# EAGLE design ControlID (EAGLE 9.6.2)
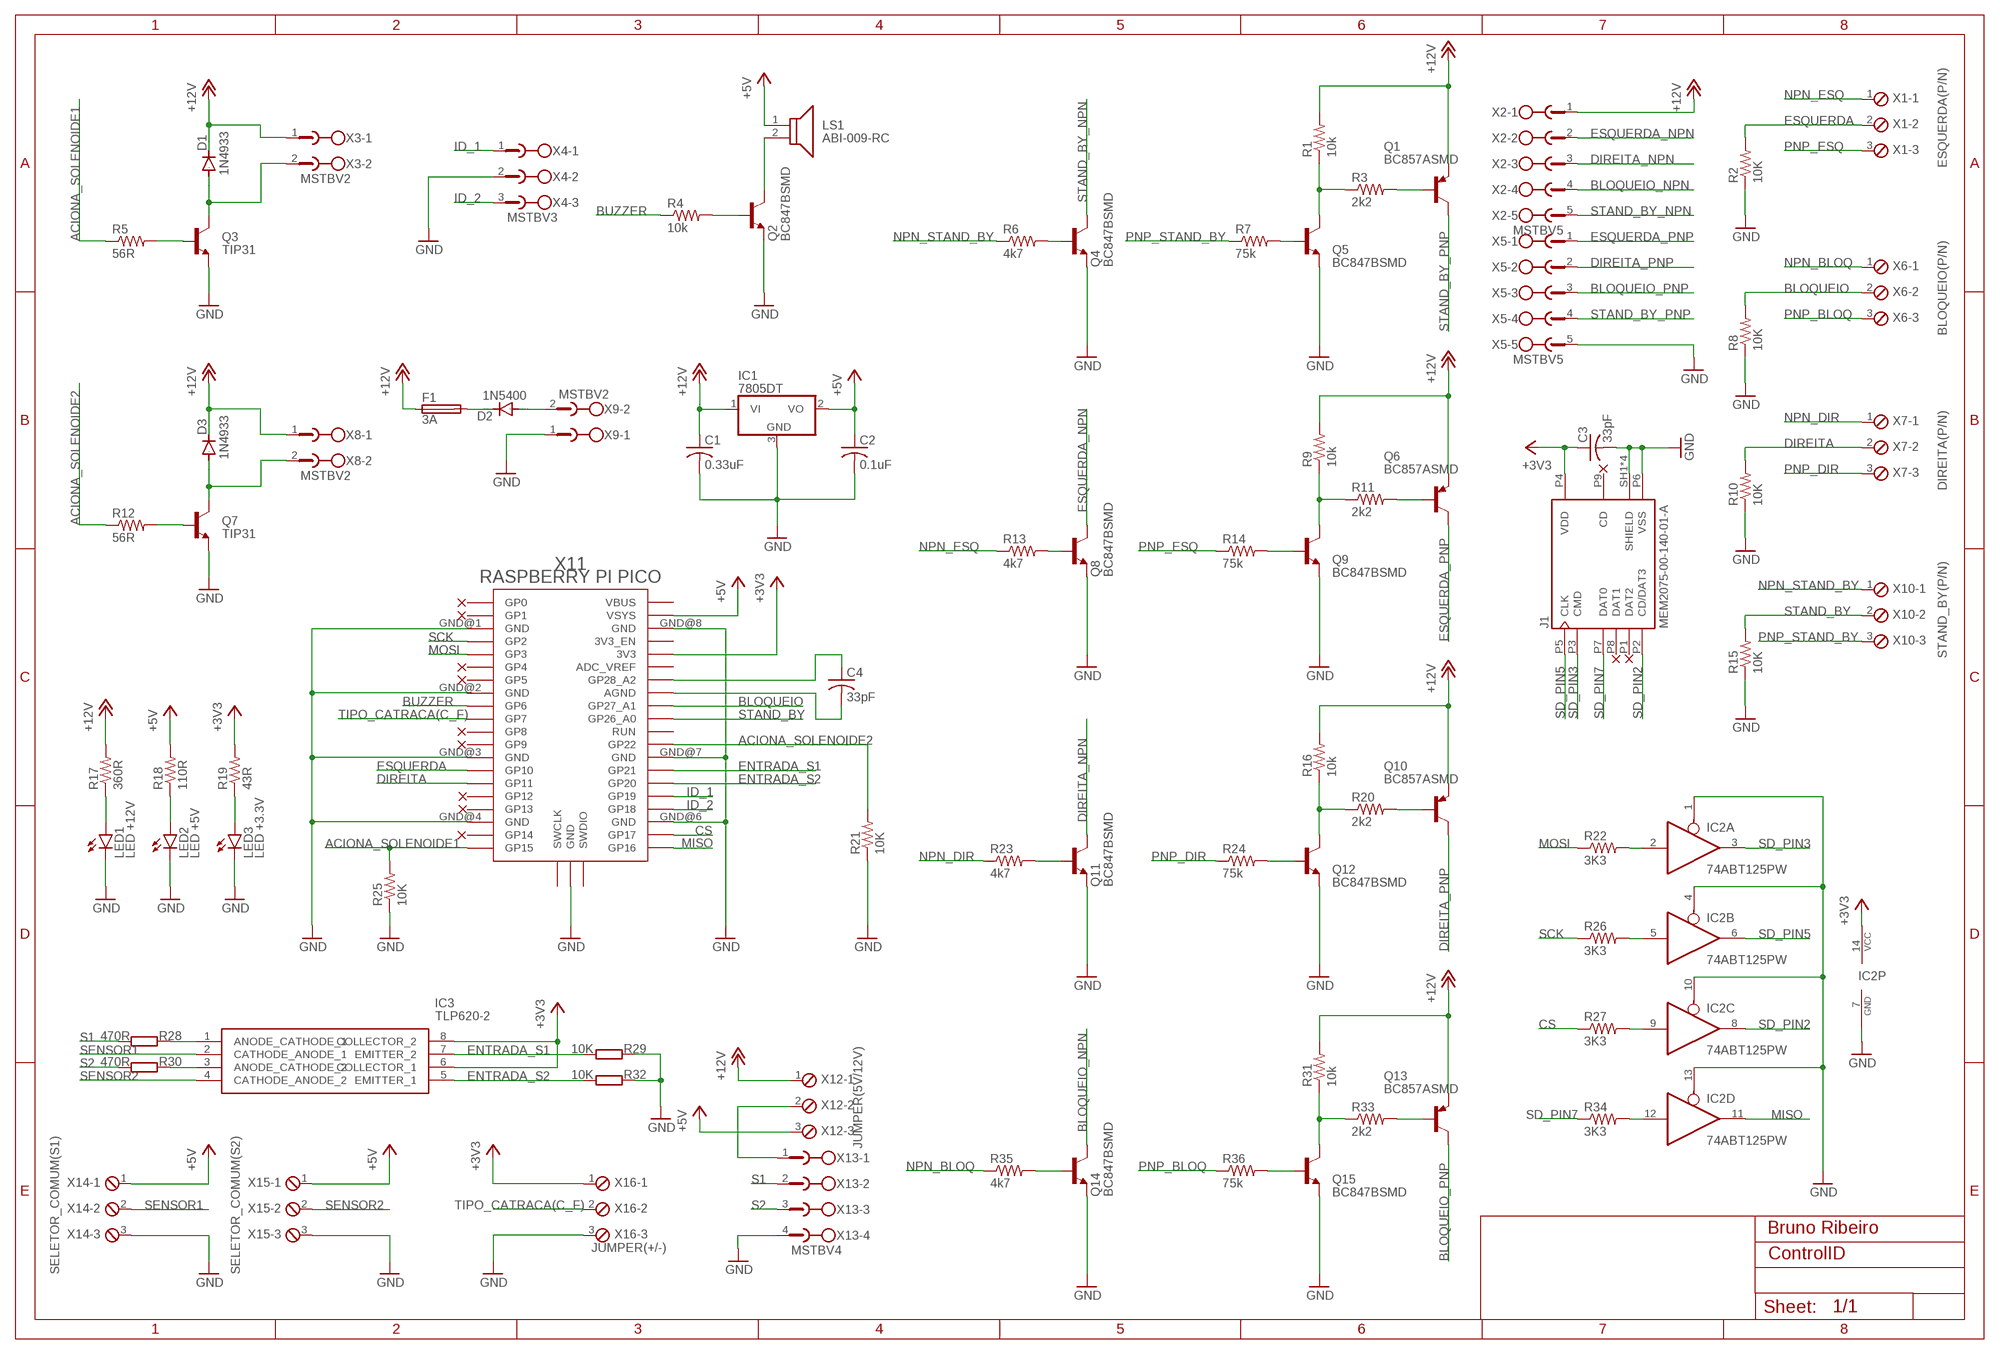
[diagram p0: schematic, sheet 1]

## Parts
C1  0.33uF  C-USC0805  [C0805]
C2  0.1uF  C-USC0805  [C0805]
C3  33pF  C-USC0805  [C0805]
C4  33pF  C-USC0805  [C0805]
D1  1N4933  [DO41-10]
D2  1N5400  [DO201-15]
D3  1N4933  [DO41-10]
F1  3A  SH22,5A  [SH22,5A]
IC1  7805DT  [TO252]
IC2  74ABT125PW  [TSSOP14]
IC3  TLP620-2  [DIP762W60P254L966H485Q8N]
J1  MEM2075-00-140-01-A  [GCT_MEM2075-00-140-01-A]
LED1  LED +12V  LEDCHIP-LED0805  [CHIP-LED0805]
LED2  LED +5V  LEDCHIP-LED0805  [CHIP-LED0805]
LED3  LED +3.3V  LEDCHIP-LED0805  [CHIP-LED0805]
LS1  ABI-009-RC  [ABI-009-RC]
Q1  BC857ASMD  [SOT23-BEC]
Q2  BC847BSMD  [SOT23]
Q3  TIP31  [TO254P1060X482X2222-3]
Q4  BC847BSMD  [SOT23]
Q5  BC847BSMD  [SOT23]
Q6  BC857ASMD  [SOT23-BEC]
Q7  TIP31  [TO254P1060X482X2222-3]
Q8  BC847BSMD  [SOT23]
Q9  BC847BSMD  [SOT23]
Q10  BC857ASMD  [SOT23-BEC]
Q11  BC847BSMD  [SOT23]
Q12  BC847BSMD  [SOT23]
Q13  BC857ASMD  [SOT23-BEC]
Q14  BC847BSMD  [SOT23]
Q15  BC847BSMD  [SOT23]
R1  10k  R-US_R0805  [R0805]
R2  10K  R-US_R0805  [R0805]
R3  2k2  R-US_R0805  [R0805]
R4  10k  R-US_R0805  [R0805]
R5  56R  R-US_R0805  [R0805]
R6  4k7  R-US_R0805  [R0805]
R7  75k  R-US_R0805  [R0805]
R8  10K  R-US_R0805  [R0805]
R9  10k  R-US_R0805  [R0805]
R10  10K  R-US_R0805  [R0805]
R11  2k2  R-US_R0805  [R0805]
R12  56R  R-US_R0805  [R0805]
R13  4k7  R-US_R0805  [R0805]
R14  75k  R-US_R0805  [R0805]
R15  10K  R-US_R0805  [R0805]
R16  10k  R-US_R0805  [R0805]
R17  360R  R-US_R0805  [R0805]
R18  110R  R-US_R0805  [R0805]
R19  43R  R-US_R0805  [R0805]
R20  2k2  R-US_R0805  [R0805]
R21  10K  R-US_R0805  [R0805]
R22  3K3  R-US_R0805  [R0805]
R23  4k7  R-US_R0805  [R0805]
R24  75k  R-US_R0805  [R0805]
R25  10K  R-US_R0805  [R0805]
R26  3K3  R-US_R0805  [R0805]
R27  3K3  R-US_R0805  [R0805]
R28  470R  R-EU_R0805  [R0805]
R29  10K  R-EU_R0805  [R0805]
R30  470R  R-EU_R0805  [R0805]
R31  10k  R-US_R0805  [R0805]
R32  10K  R-EU_R0805  [R0805]
R33  2k2  R-US_R0805  [R0805]
R34  3K3  R-US_R0805  [R0805]
R35  4k7  R-US_R0805  [R0805]
R36  75k  R-US_R0805  [R0805]
X1  ESQUERDA(P/N)  MPT3  [3POL254]
X2  MSTBV5  [MSTBV5]
X3  MSTBV2  [MSTBV2]
X4  MSTBV3  [MSTBV3]
X5  MSTBV5  [MSTBV5]
X6  BLOQUEIO(P/N)  MPT3  [3POL254]
X7  DIREITA(P/N)  MPT3  [3POL254]
X8  MSTBV2  [MSTBV2]
X9  MSTBV2  [MSTBV2]
X10  STAND_BY(P/N)  MPT3  [3POL254]
X11  RASPBERRY PI PICO  RPI_PICO_IG-TH  [RPI_PICO_TH]
X12  JUMPER(5V/12V)  MPT3  [3POL254]
X13  MSTBV4  [MSTBV4]
X14  SELETOR_COMUM(S1)  MPT3  [3POL254]
X15  SELETOR_COMUM(S2)  MPT3  [3POL254]
X16  JUMPER(+/-)  MPT3  [3POL254]

## Nets
+3V3: C3.1 IC2.14(P:VCC) IC3.6(COLLECTOR_1) IC3.8(COLLECTOR_2) J1.P4(VDD) R19.2 X11.3V3 X16.1
+5V [Alimentação]: C2.1 IC1.2(VO) LS1.1 R18.2 X11.VSYS X12.3 X14.1 X15.1
+12V [Alimentação]: C1.1 D1.C D3.C F1.1 IC1.1(VI) Q1.E Q6.E Q10.E Q13.E R1.2 R9.2 R16.2 R17.2 R31.2 X2.1 X3.1 X8.1 X12.1
ACIONA_SOLENOIDE1: R5.1 R25.2 X11.GP15
ACIONA_SOLENOIDE2: R12.1 R21.2 X11.GP22
BLOQUEIO: R8.2 X6.2 X11.GP27_A1
BLOQUEIO_NPN: Q14.3(C) X2.4
BLOQUEIO_PNP: Q13.C X5.3
BUZZER: R4.1 X11.GP6
CS: R27.1 X11.GP17
DIREITA: R10.2 X7.2 X11.GP11
DIREITA_NPN: Q11.3(C) X2.3
DIREITA_PNP: Q10.C X5.2
ENTRADA_S1: IC3.7(EMITTER_2) R29.2 X11.GP21
ENTRADA_S2: IC3.5(EMITTER_1) R32.2 X11.GP20
ESQUERDA: R2.2 X1.2 X11.GP10
ESQUERDA_NPN: Q8.3(C) X2.2
ESQUERDA_PNP: Q6.C X5.1
GND: C1.2 C2.2 C3.2 IC1.3(GND) IC2.1(A:OE) IC2.4(B:OE) IC2.7(P:GND) IC2.10(C:OE) IC2.13(D:OE) J1.P6(VSS) J1.SH1(SHIELD) J1.SH2(SHIELD) J1.SH3(SHIELD) J1.SH4(SHIELD) LED1.C LED2.C LED3.C Q2.2(E) Q3.3(E) Q4.2(E) Q5.2(E) Q7.3(E) Q8.2(E) Q9.2(E) Q11.2(E) Q12.2(E) Q14.2(E) Q15.2(E) R2.1 R8.1 R10.1 R15.1 R21.1 R25.1 R29.1 R32.1 X4.2 X5.5 X9.1 X11.GND@1(GND) X11.GND@2(GND) X11.GND@3(GND) X11.GND@4(GND) X11.GND@5(GND) X11.GND@6(GND) X11.GND@7(GND) X11.GND@8(GND) X13.4 X14.3 X15.3 X16.3
ID_1: X4.1 X11.GP19
ID_2: X4.3 X11.GP18
MISO: IC2.11(D:O) X11.GP16
MOSI: R22.1 X11.GP3
N$1: Q3.1(B) R5.2
N$2: Q7.1(B) R12.2
N$3: X12.2 X13.1
N$4 [Alimentação]: D2.A X9.2
N$5: Q8.1(B) R13.2
N$6: LED1.A R17.1
N$7: LED2.A R18.1
N$8: LED3.A R19.1
N$9 [Alimentação]: D2.C F1.2
N$10: Q4.1(B) R6.2
N$11 [Alimentação]: D1.A Q3.2(C) X3.2
N$12: Q9.3(C) R9.1 R11.1
N$13 [Alimentação]: D3.A Q7.2(C) X8.2
N$14: Q9.1(B) R14.2
N$15: Q6.B R11.2
N$16: Q15.3(C) R31.1 R33.1
N$17: Q5.3(C) R1.1 R3.1
N$18: Q5.1(B) R7.2
N$19: Q11.1(B) R23.2
N$20: Q1.B R3.2
N$21: Q15.1(B) R36.2
N$22: Q14.1(B) R35.2
N$23: C4.1 X11.GP28_A2
N$24: Q13.B R33.2
N$25: C4.2 X11.AGND
N$26: Q12.3(C) R16.1 R20.1
N$27: Q2.1(B) R4.2
N$28: Q12.1(B) R24.2
N$29: Q10.B R20.2
N$30: LS1.2 Q2.3(C)
N$36: IC3.3(ANODE_CATHODE_2) R30.1
N$37: IC3.1(ANODE_CATHODE_1) R28.1
N$38: IC2.2(A:I) R22.2
N$39: IC2.5(B:I) R26.2
N$40: IC2.9(C:I) R27.2
N$41: IC2.12(D:I) R34.2
NPN_BLOQ: R35.1 X6.1
NPN_DIR: R23.1 X7.1
NPN_ESQ: R13.1 X1.1
NPN_STAND_BY: R6.1 X10.1
PNP_BLOQ: R36.1 X6.3
PNP_DIR: R24.1 X7.3
PNP_ESQ: R14.1 X1.3
PNP_STAND_BY: R7.1 X10.3
S1: R28.2 X13.2
S2: R30.2 X13.3
SCK: R26.1 X11.GP2
SD_PIN2: IC2.8(C:O) J1.P2(CD/DAT3)
SD_PIN3: IC2.3(A:O) J1.P3(CMD)
SD_PIN5: IC2.6(B:O) J1.P5(CLK)
SD_PIN7: J1.P7(DAT0) R34.1
SENSOR1: IC3.2(CATHODE_ANODE_1) X14.2
SENSOR2: IC3.4(CATHODE_ANODE_2) X15.2
STAND_BY: R15.2 X10.2 X11.GP26_A0
STAND_BY_NPN: Q4.3(C) X2.5
STAND_BY_PNP: Q1.C X5.4
TIPO_CATRACA(C_F): X11.GP7 X16.2
Unconnected: J1.P1(DAT2) J1.P8(DAT1) J1.P9(CD) X11.3V3_EN X11.ADC_VREF X11.GP0 X11.GP1 X11.GP4 X11.GP5 X11.GP8 X11.GP9 X11.GP12 X11.GP13 X11.GP14 X11.RUN X11.SWCLK X11.SWDIO X11.VBUS

## Notes on the sheet
- Bruno Ribeiro

## Library data of the parts
C1-C4 = rcl:C-US: CAPACITOR, American symbol; SPICEPREFIX: C
D1 D3 = diode:1N4933: DIODE fast recovery rectifier, 1A
D2 = diode:1N5400: DIODE standard rectifier, 3 A, 50 V (Motorola)
F1 = fuse:SH22,5A: FUSE HOLDER grid 22,5mm, isolated cap OGN0031 8201, Schurter (Buerklin); MPN: 0031.7701.11; OC_FARNELL: unknown; OC_NEWARK: 04F1224
IC1 = linear:78*: Positive VOLTAGE REGULATOR Source: http://cache.national.com/ds/LM/LM78L05.pdf http://www.fairchildsemi.com/ds/LM/LM7805.pdf
IC2 = 74xx-us:74*125: Quad bus BUFFER, 3-state
IC3 = TLP620-2:TLP620-2: TOSHIBA - TLP620-2 - OPTOCOUPLER, DUAL, 5KV, TRANSTR O/P Source: Datasheet <https://componentsearchengine.com/Datasheets/2/TLP620-2.pdf>; DESCRIPTION: TOSHIBA - TLP620-2 - OPTOCOUPLER, DUAL, 5KV, TRANSTR O/P; HEIGHT: 4.85mm; MANUFACTURER_NAME: Toshiba; MANUFACTURER_PART_NUMBER: TLP620-2
J1 = MEM2075-00-140-01-A:MEM2075-00-140-01-A: Micro SD Memory Card Connector, 1.4mm Profile SMT, Push-Push, with Normally open Switch Check availability <https://pricing.snapeda.com/parts/MEM2075-00-140-01-A/Global%20Connector%20Technology/view-part?ref=eda>; AVAILABILITY: In Stock; CHECK_PRICES: https://www.snapeda.com/parts/MEM2075-00-140-01-A/Global+Connector+Technology/view-part/?ref=eda; DESCRIPTION: 9 (8 + 1) Position Card Connector microSD Surface Mount, Right Angle Gold; MF: Global Connector Technology; MP: MEM2075-00-140-01-A; PACKAGE: None; PRICE: None; SNAPEDA_LINK: https://www.snapeda.com/parts/MEM2075-00-140-01-A/Global+Connector+Technology/view-part/?ref=snap
LED1-LED3 = led:LED: LED OSRAM: - CHIPLED LG R971, LG N971, LY N971, LG Q971, LY Q971, LO R971, LY R971 LH N974, LH R974 LS Q976, LO Q976, LY Q976 LO Q996 - Hyper CHIPLED LW Q18S LB Q993, LB Q99A, LB R99A - SideLED LS A670, LO A670, LY A670, LG A670, LP A670 LB A673, LV A673, LT A673, LW A673 LH A674 LY A675 LS A676, LA A676, LO A676, LY A676, LW A676 LS A679, LY A679, LG A679 - Hyper Micro SIDELED® LS Y876, LA Y876, LO Y876, LY Y876 LT Y87S - SmartLED LW L88C, LW L88S LB L89C, LB L89S, LG L890 LS L89K, LO L89K, LY L89K LS L896, LA L896, LO L896, LY L896 - TOPLED LS T670, LO T670, LY T670, LG T670, LP T670 LSG T670, LSP T670, LSY T670, LOP T670, LYG T670 LG T671, LOG T671, LSG T671 LB T673, LV T673, LT T673, LW T673 LH T674 LS T676, LA T676, LO T676, LY T676, LB T676, LH T676, LSB T676, LW T676 LB T67C, LV T67C, LT T67C, LS T67K, LO T67K, LY T67K, LW E67C LS E67B, LA E67B, LO E67B, LY E67B, LB E67C, LV E67C, LT E67C LW T67C LS T679, LY T679, LG T679 LS T770, LO T770, LY T770, LG T770, LP T770 LB T773, LV T773, LT T773, LW T773 LH T774 LS E675, LA E675, LY E675, LS T675 LS T776, LA T776, LO T776, LY T776, LB T776 LHGB T686 LT T68C, LB T68C - Hyper Mini TOPLED® LB M676 - Mini TOPLED Santana® LG M470 LS M47K, LO M47K, LY M47K Source: http://www.osram.convergy.de LUXEON: - LUMILED® LXK2-PW12-R00, LXK2-PW12-S00, LXK2-PW14-U00, LXK2-PW14-V00 LXK2-PM12-R00, LXK2-PM12-S00, LXK2-PM14-U00 LXK2-PE12-Q00, LXK2-PE12-R00, LXK2-PE12-S00, LXK2-PE14-T00, LXK2-PE14-U00 LXK2-PB12-K00, LXK2-PB12-L00, LXK2-PB12-M00, LXK2-PB14-N00, LXK2-PB14-P00, LXK2-PB14-Q00 LXK2-PR12-L00, LXK2-PR12-M00, LXK2-PR14-Q00, LXK2-PR14-R00 LXK2-PD12-Q00, LXK2-PD12-R00, LXK2-PD12-S00 LXK2-PH12-R00, LXK2-PH12-S00 LXK2-PL12-P00, LXK2-PL12-Q00, LXK2-PL12-R00 Source: www.luxeon.com KINGBRIGHT: KA-3528ASYC Source: www.kingbright.com
LS1 = ABI-009-RC:ABI-009-RC: PRO SIGNAL - ABI-009-RC - BUZZER, ELECTROMECH, 6VDC Source: Datasheet; DESCRIPTION: PRO SIGNAL - ABI-009-RC - BUZZER, ELECTROMECH, 6VDC; HEIGHT: mm; MANUFACTURER_NAME: PRO SIGNAL; MANUFACTURER_PART_NUMBER: ABI-009-RC
Q1 Q6 Q10 Q13 = transistor-pnp:BC857*: PNP Transistror
Q2 Q4 Q5 Q8 Q9 Q11 Q12 Q14 Q15 = transistor-npn:BC847*: NPN Transistor
Q3 Q7 = TIP31:TIP31: Bipolar (BJT) Transistor NPN 40V 3A 3MHz 2W Through Hole TO-220AB Check availability <https://pricing.snapeda.com/parts/TIP31/ON%20Semiconductor/view-part?ref=eda>; AVAILABILITY: In Stock; DESCRIPTION: Bipolar (BJT) Transistor NPN 60 V 3 A 3MHz 2 W Through Hole TO-220-3; MF: ON Semiconductor; MP: TIP31; PACKAGE: TO-220-3 ON Semiconductor; PRICE: None; PURCHASE-URL: https://pricing.snapeda.com/search/part/TIP31/?ref=eda
R1-R27 R31 R33-R36 = rcl:R-US_: RESISTOR, American symbol; SPICEPREFIX: R
R28-R30 R32 = rcl:R-EU_: RESISTOR, European symbol; SPICEPREFIX: R
X1 X6 X7 X10 X12 X14-X16 = con-phoenix-254:MPT3: PHOENIX CONNECTOR; OC_FARNELL: unknown; OC_NEWARK: unknown
X2 X5 = con-phoenix-508:MSTBV5: PHOENIX; MPN: MSTBV 2,5/5-GF-5.08; OC_FARNELL: 1792795; OC_NEWARK: 69R9848
X3 X8 X9 = con-phoenix-508:MSTBV2: PHOENIX; MPN: MSTBV 2,5/2-GF-5.08; OC_FARNELL: 1792792; OC_NEWARK: 69R9845
X4 = con-phoenix-508:MSTBV3: PHOENIX; MPN: MSTBV 2,5/3-GF-5.08; OC_FARNELL: 1792793; OC_NEWARK: 69R9846
X11 = RaspberryPi_Pico:RPI_PICO_IG
X13 = con-phoenix-508:MSTBV4: PHOENIX; MPN: MSTBV 2,5/4-GF-5.08; OC_FARNELL: 1792794; OC_NEWARK: 69R9847

## Net classes
1 Alimentação: width 1.397 mm
2 Raspibarry: width 2.032 mm

## Board
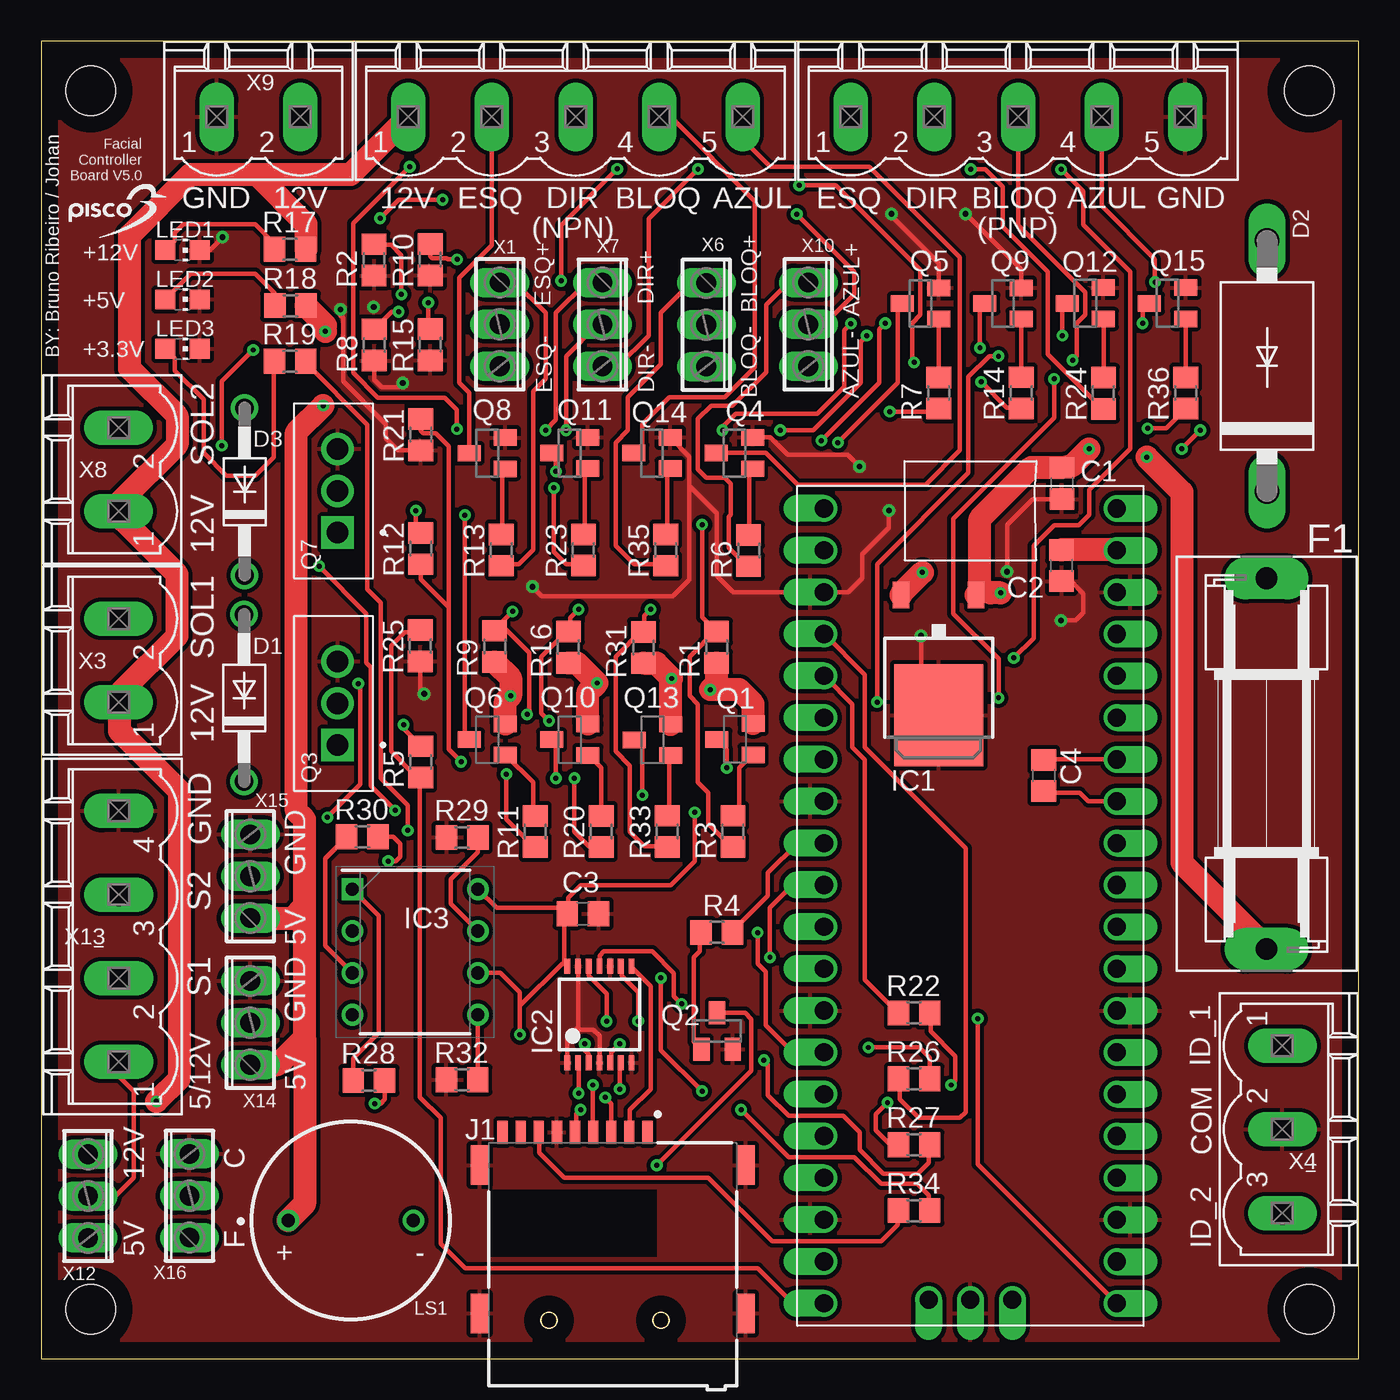
[diagram p1: board, top side]
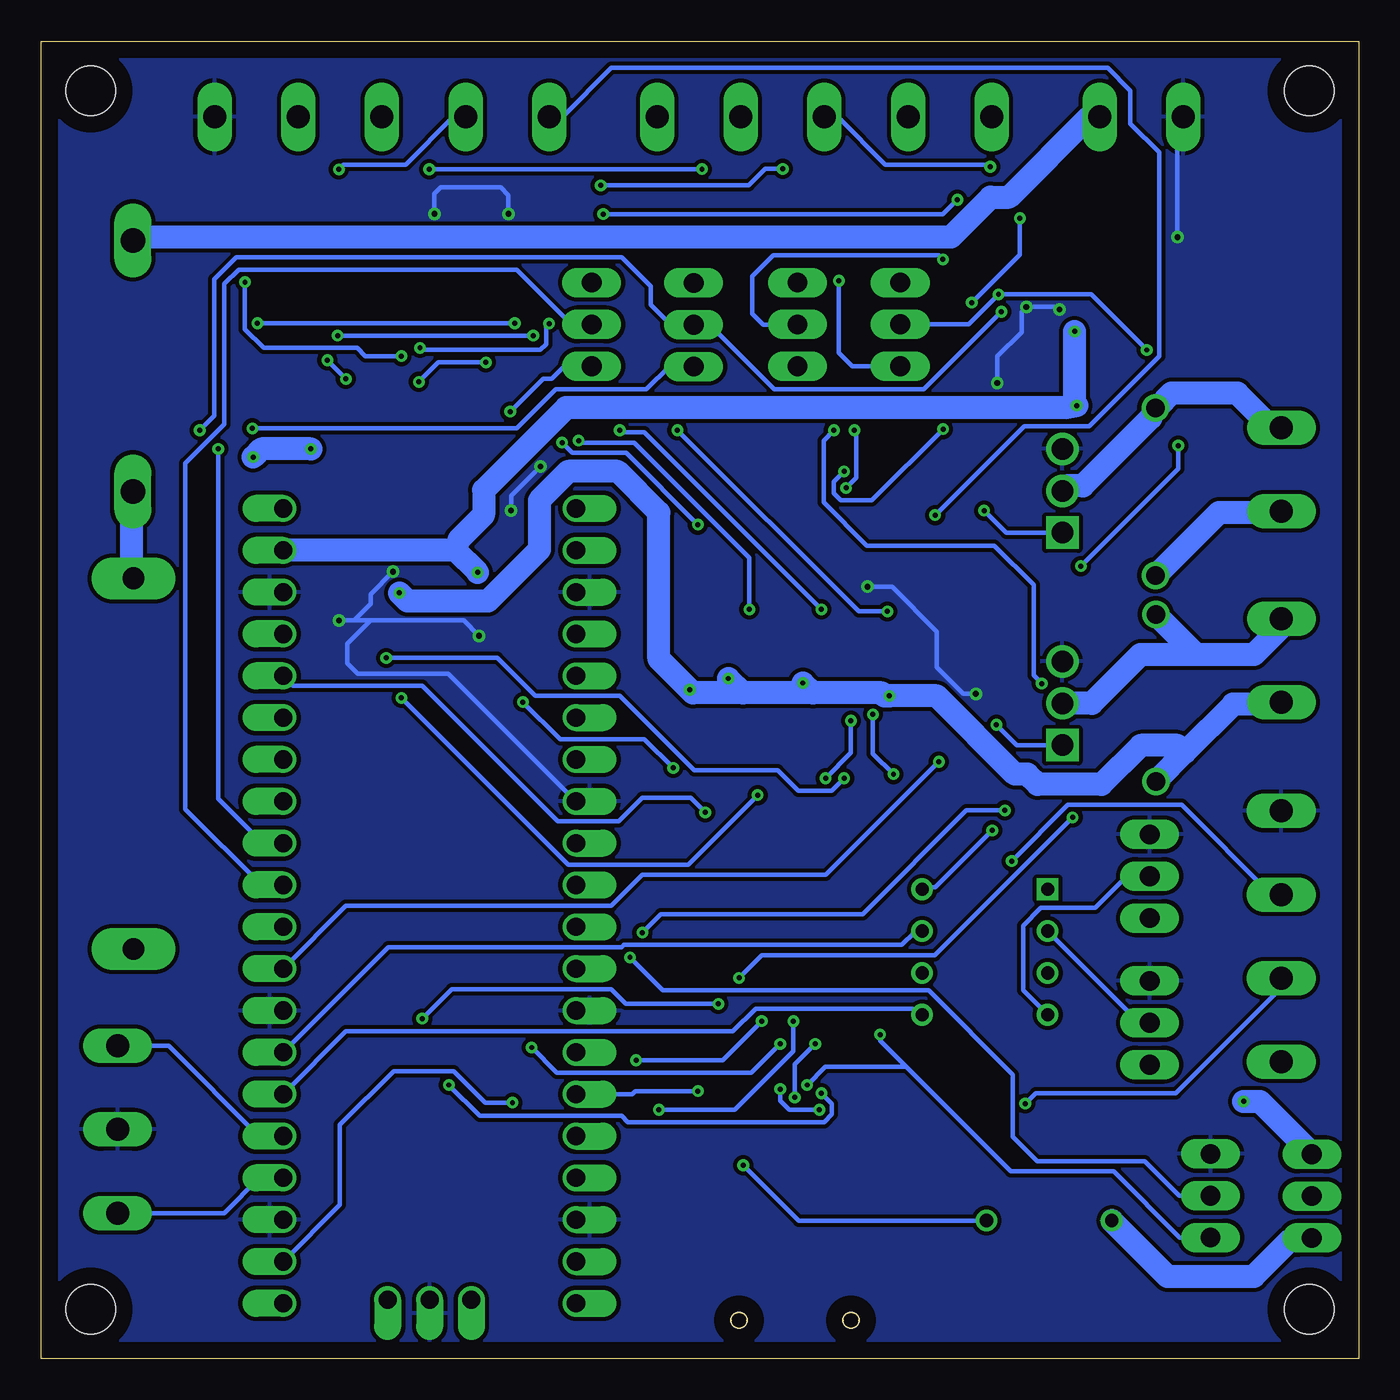
[diagram p2: board, bottom side, seen from below]

Size 80 x 80 mm. Coordinates in mm from the lower left corner, seen from the top.
Outline: 30.36,2.31 arc174 31.31,2.31 31.31,2.37 arc174 30.36,2.37 30.36,2.31
Outline: 37.16,2.31 arc174 38.11,2.31 38.11,2.37 arc174 37.16,2.37 37.16,2.31
Outline: 0,80 0,0 80,0 80,80 0,80
Copper layers (1*16): Top 0.035mm / dielectric 1.5mm / Bottom 0.035mm
Design rules "default *": minimum track width 0.26mm, minimum drill 0.3mm, track to track 0.25mm, track to pad 0.25mm, pad to pad 0.25mm, via to via 0.25mm, smd to smd 0.25mm, copper to edge 40mil, drill to drill 8mil, minimum pad ring 10mil, minimum via ring 8mil, stop-mask expansion 4mil, vias tented up to drill 0mil, thermal gap 10mil
Holes 3 mm at 77,3 3,3 3,77 77,77

### Footprints (pad centres in the part's own frame; a part is rotated, then mirrored left to right if it is on the bottom)
C0805 = smd 1.3 x 1.5: 1 -0.95,0; 2 0.95,0
DO41-10 = drill 1.118: A 5.08,0; C -5.08,0
DO201-15 = drill 1.499 long: A 7.62,0; C -7.62,0
SH22,5A = drill 1.321 pad 2.54 long: 1 -11.252,0; 2 11.252,0
TO252 = smd 1 x 1.6: 1 -2.28,-4.8; 2 2.28,-4.8 | smd 5.4 x 6.2: 3 0,2.5
TSSOP14 = smd 0.35 x 0.9: 1 -1.95,-2.925; 2 -1.3,-2.925; 3 -0.65,-2.925; 4 0,-2.925; 5 0.65,-2.925; 6 1.3,-2.925; 7 1.95,-2.925; 8 1.95,2.925; 9 1.3,2.925; 10 0.65,2.925; 11 0,2.925; 12 -0.65,2.925; 13 -1.3,2.925; 14 -1.95,2.925
DIP762W60P254L966H485Q8N = drill 0.8 pad 1.2 square: 1 -3.81,3.81 | drill 0.8 pad 1.2: 2 -3.81,1.27; 3 -3.81,-1.27; 4 -3.81,-3.81; 5 3.81,-3.81; 6 3.81,-1.27; 7 3.81,1.27; 8 3.81,3.81
GCT_MEM2075-00-140-01-A = smd 0.62 x 1.4: P1 2.58,11.42; P2 1.48,11.42; P3 0.38,11.42; P4 -0.72,11.42; P5 -1.82,11.42; P6 -2.92,11.42; P7 -4.02,11.42; P8 -5.12,11.42; P9 -6.22,11.42 | smd 1.1 x 2.4: SH1 -7.6,0.42; SH2 -7.6,9.42; SH3 8.55,9.42; SH4 8.55,0.42 | hole 0.95: -3.4,0; 3.4,0
CHIP-LED0805 = smd 1.2 x 1.2: A 0,-1.05; C 0,1.05
ABI-009-RC = drill 0.8 pad 1.3: 1 0,-3.8; 2 0,3.8
SOT23-BEC = smd 1 x 1.4: B -0.95,-1.1; C 0,1.1; E 0.95,-1.1
SOT23 = smd 1 x 1.4: 1 -0.95,-1.1; 2 0.95,-1.1; 3 0,1.1
TO254P1060X482X2222-3 = drill 1.31 square: 1 -2.54,0 | drill 1.31: 2 0,0; 3 2.54,0
R0805 = smd 1.3 x 1.5: 1 -0.95,0; 2 0.95,0
3POL254 = drill 1.2 long: 1 -2.54,0; 2 0,0; 3 2.54,0
MSTBV5 = drill 1.397 long: 1 -10.16,0; 2 -5.08,0; 3 0,0; 4 5.08,0; 5 10.16,0
MSTBV2 = drill 1.397 long: 1 -2.54,0; 2 2.54,0
MSTBV3 = drill 1.397 long: 1 -5.08,0; 2 0,0; 3 5.08,0
RPI_PICO_TH = drill 1.1 pad 1.6 offset: 3V3 8.89,13.97; 3V3_EN 8.89,16.51; ADC_VREF 8.89,11.43; AGND 8.89,6.35; GND@1 -8.89,19.05; GND@2 -8.89,6.35; GND@3 -8.89,-6.35; GND@4 -8.89,-19.05; GND@5 0,-23.9; GND@6 8.89,-19.05; GND@7 8.89,-6.35; GND@8 8.89,19.05; GP0 -8.89,24.13; GP1 -8.89,21.59; GP2 -8.89,16.51; GP3 -8.89,13.97; GP4 -8.89,11.43; GP5 -8.89,8.89; GP6 -8.89,3.81; GP7 -8.89,1.27; GP8 -8.89,-1.27; GP9 -8.89,-3.81; GP10 -8.89,-8.89; GP11 -8.89,-11.43; GP12 -8.89,-13.97; GP13 -8.89,-16.51; GP14 -8.89,-21.59; GP15 -8.89,-24.13; GP16 8.89,-24.13; GP17 8.89,-21.59; GP18 8.89,-16.51; GP19 8.89,-13.97; GP20 8.89,-11.43; GP21 8.89,-8.89; GP22 8.89,-3.81; GP26_A0 8.89,1.27; GP27_A1 8.89,3.81; GP28_A2 8.89,8.89; RUN 8.89,-1.27; SWCLK -2.54,-23.9; SWDIO 2.54,-23.9; VBUS 8.89,24.13; VSYS 8.89,21.59
MSTBV4 = drill 1.397 long: 1 -7.62,0; 2 -2.54,0; 3 2.54,0; 4 7.62,0

### Placement (x,y rotation side)
C1  61.98,53.15 270 top
C2  61.95,48.16 270 top
C3  32.89,27.02 0 top
C4  60.87,35.42 270 top
D1  12.32,40.12 90 top
D2  74.43,60.28 90 top
D3  12.35,52.65 90 top
F1  74.4,36.14 90 top
IC1  54.49,41.58 180 top
IC2  33.9,20.9 0 top
IC3  22.7,24.7 0 top
J1  34.23,2.34 0 top
LED1  8.59,67.32 270 top
LED2  8.59,64.32 270 top
LED3  8.59,61.32 270 top
LS1  18.8,8.4 270 top
Q1  42.13,37.62 90 top
Q2  41.04,19.91 0 top
Q3  18,39.8 90 top
Q4  42.09,54.99 90 top
Q5  53.39,64.07 90 top
Q6  27.09,37.6 90 top
Q7  18,52.7 90 top
Q8  27.08,54.98 90 top
Q9  58.4,64.08 90 top
Q10  32.09,37.59 90 top
Q11  32.09,54.99 90 top
Q12  63.38,64.08 90 top
Q13  37.11,37.58 90 top
Q14  37.09,54.99 90 top
Q15  68.39,64.08 90 top
R1  41.01,43.21 270 top
R2  20.21,66.72 90 top
R3  41.99,32.02 90 top
R4  41.02,25.89 180 top
R5  23.05,36.24 90 top
R6  42.95,49.07 90 top
R7  54.49,58.64 90 top
R8  20.23,61.56 90 top
R9  27.53,43.26 270 top
R10  23.62,66.73 90 top
R11  30,32.02 90 top
R12  23.05,49.19 90 top
R13  27.93,49.1 90 top
R14  59.5,58.65 90 top
R15  23.62,61.57 90 top
R16  32.01,43.21 270 top
R17  15.12,67.36 0 top
R18  15.14,63.94 0 top
R19  15.11,60.56 0 top
R20  34.01,32.02 90 top
R21  23.05,56.11 90 top
R22  53,21 0 top
R23  32.92,49.11 90 top
R24  64.49,58.63 90 top
R25  23.02,43.29 90 top
R26  53,17 0 top
R27  53,13 0 top
R28  19.9,16.9 0 top
R29  25.56,31.65 0 top
R30  19.5,31.7 0 top
R31  36.57,43.18 270 top
R32  25.55,16.94 0 top
R33  38.01,32.02 90 top
R34  53,9 0 top
R35  37.92,49.1 90 top
R36  69.49,58.64 90 top
X1  27.84,62.81 270 top
X2  32.44,75.4 0 top
X3  4.7,42.4 90 top
X4  75.36,13.93 270 top
X5  59.31,75.41 0 top
X6  40.39,62.78 270 top
X7  34.08,62.8 270 top
X8  4.7,54 90 top
X9  13.2,75.4 0 top
X10  46.58,62.8 270 top
X11  56.42,27.5 0 top
X12  2.85,9.88 270 top
X13  4.71,25.65 90 top
X14  12.7,20.4 90 top
X15  12.7,29.3 90 top
X16  9,9.9 90 top

### Tracks (layer width: path | path; a pad name or v marks a point on that pad's centre or on a via)
+3V3  (via drill 0.3)
  Top 0.26: R19.2 16.06,60.47 19.81,56.72 19.81,46.72 20.62,45.91 20.62,35.25 22.26,33.62 v22.26,32.08 | 31.75,24 31.88,23.88 IC2.14 | 31.75,24 31.75,26.88 31.88,27 C3.1 | v33.5,16.62 33.5,13.88 J1.P4 | 29.07,21.44 31.62,24 31.75,24 | C3.1 32,27.12 32,28 32.75,28.75 38.22,28.75 39.68,30.21 v39.68,33.18 | C3.1 31.88,27.38 27.64,27.38 IC3.8 | 29.07,21.44 v29.07,19.68 | IC3.6 27.89,23.43 29.07,22.25 29.07,21.44
  Bottom 0.26: v22.26,32.08 25.72,28.62 26.5,28.62 IC3.8 | v33.5,16.62 32.41,17.72 27.47,17.72 | v39.68,33.18 40.56,34.06 43.5,34.06 44.93,32.62 48.62,32.62 56.88,40.88 64.72,40.88 X11.3V3 | 27.47,17.72 21.12,11.38 14.88,11.38 10.86,7.36 X16.1 | v29.07,19.68 29.07,19.32 27.47,17.72
+5V  (via drill 0.3)
  Top 1.397: C2.1 62,49.12 65.25,49.12 X11.VSYS | v53.5,47.75 52.25,46.5 IC1.2 | v17.25,62.38 17.25,62.75 16.12,63.88 R18.2 | v17.12,57.88 15.5,56.25 15.5,33.25 16,32.75 16,27.5 | LS1.1 16,9.4 16,19.51 | 16,19.51 16,27.5 | X14.1 14.35,17.86 16,19.51 | X15.1 15.26,26.76 16,27.5
  Bottom 1.397: X12.3 2.88,7.25 4.12,7.25 6.38,5 11.62,5 15,8.38 LS1.1 | 54.88,49.12 v53.5,47.75 | 54.88,49.12 65.25,49.12 X11.VSYS | 17.25,57.88 v17.25,62.38 | v17.12,57.88 17.25,57.88 | 54.88,49.12 54.62,49.75 53.13,51.24 53.13,52.74 48.12,57.75 17.88,57.75 17.25,57.88
+12V  (via drill 0.3)
  Top 1.397: 57,46.62 57,51 60.12,54.12 61.88,54.12 C1.1 62.62,54.25 v63.62,55.25 | 57,46.62 56.88,46.5 IC1.1 | v67.12,54.75 69.25,52.62 69.25,30.12 74.38,25 F1.1 | v7,15.62 8.38,17 8.38,34.5 4.75,38.12 4.75,39.75 X3.1 4.88,40.5 8.25,43.88 8.25,47.62 5,50.88 X8.1 4.75,51.5 4.75,52 8.25,55.5 8.25,57.25 5.38,60.12 5.38,68.22 9.07,71.91 13.04,71.91 | v58.25,46.5 57.62,46.5 57,46.62 | R31.2 37.35,42.23 v38.27,41.3 38.21,41.24 Q13.E | Q10.E 33.2,40.47 v33.75,41.03 32.53,42.26 R16.2 | R9.2 28.5,41.34 v28.5,40.25 28.19,39.94 Q6.E | Q1.E 43.23,39.77 42.38,40.62 v40.62,40.62 41.01,41.01 R1.2 | 13.04,71.91 16.07,68.89 R17.2 | X2.1 18.79,71.91 13.04,71.91
  Bottom 1.397: v67.12,54.75 66.62,55.25 v63.62,55.25 | D3.C 12.25,47.62 8.5,51.38 4.75,51.38 X8.1 | 10.56,36.81 7.62,39.75 4.75,39.75 X3.1 | 10.56,36.81 12.25,35.12 D1.C | v7,15.62 6,15.62 2.88,12.5 X12.1 | 10.56,36.81 11,37.25 13.25,37.25 15.62,34.88 19.5,34.88 20.12,35.5 20.88,35.5 25.62,40.25 v28.5,40.25 28.78,40.25 28.96,40.43 33.15,40.43 | v58.25,46.5 57.75,46 52.88,46 49.75,49.12 49.75,52.12 48,53.88 45,53.88 42.5,51.38 42.5,42.5 v40.62,40.62 40.43,40.43 37.4,40.43 | 33.15,40.43 37.4,40.43 | 37.4,40.43 v38.27,41.3 | 33.15,40.43 v33.75,41.03
ACIONA_SOLENOIDE1
  Top 0.26: R25.2 23,44.12 22.07,44.12 21.25,43.3 21.25,36.88 22.75,35.38 23,35.38 R5.1 23,35.25 23,15.88 24.25,14.62 24.25,7 25.75,5.5 43.5,5.5 45.62,3.38 47.5,3.38 X11.GP15
ACIONA_SOLENOIDE2  (via drill 0.3)
  Top 0.26: v25.5,36.25 24.75,37 24.75,45.62 | 24.75,45.62 23.05,47.33 R12.1 | R21.2 23.05,56.34 23.2,56.19 23.96,56.19 24.75,55.4 24.75,45.62
  Bottom 0.26: v25.5,36.25 32.38,29.38 43.5,29.38 45.38,27.5 61.5,27.5 65.25,23.75 X11.GP22
BLOQUEIO  (via drill 0.3)
  Top 0.26: v70.38,56.38 v69.25,55.25 | R8.2 21.29,63.57 v21.7,63.57
  Bottom 0.26: v21.7,63.57 26.4,58.88 35.5,58.88 39.38,62.75 40.38,62.75 X6.2 40.5,62.88 40.62,63 42,63 43,64 43,65.12 44.75,66.88 68.16,66.88 69.5,65.54 69.5,57.25 v70.38,56.38 | v69.25,55.25 69.25,34 66.56,31.31 X11.GP27_A1
BLOQUEIO_NPN
  Top 0.26: Q14.3 36.5,55.5 36.5,56.75 38.12,58.38 41.5,58.38 43.33,60.21 43.33,70.28 38.24,75.38 37.62,75.38 X2.4
BLOQUEIO_PNP  (via drill 0.3)
  Top 0.26: v36.5,34.23 36.5,37.12 36.12,37.5 Q13.C | v58.12,40.12 58.12,42.5 55.38,45.25 55.38,51 61.5,57.12 v61.5,59.5 | v62.62,60.62 62.88,60.88 62.88,62.88 63.38,63.38 63.38,64.75 59.31,68.81 X5.3
  Bottom 0.26: v36.5,34.23 40.73,30 48,30 v58.12,40.12 | v62.62,60.62 v61.5,59.5
BUZZER
  Top 0.26: R4.1 42,26 44.12,28.12 44.12,29.5 45.93,31.31 X11.GP6
CS  (via drill 0.3)
  Top 0.26: v51.38,15.55 50.68,14.86 50.68,13.87 51.55,13 R27.1
  Bottom 0.26: v51.38,15.55 53.04,15.55 54.95,17.47 58.6,17.47 61.86,14.21 61.86,9.36 X11.GP17
DIREITA  (via drill 0.3)
  Top 0.26: v40.12,16.25 37.62,18.75 v37.62,23.12 | v17.38,32.88 19.38,34.88 19.38,40.88 v19.25,41 | v31.88,56.38 31.88,60.88 33.8,62.8 X7.2 | R10.2 23.62,66.93 23.74,66.81 24.61,66.81 24.67,66.75 v25.25,66.75
  Bottom 0.26: v25.25,66.75 25.5,67 35.55,67 36.83,65.72 36.83,63.47 36.15,62.78 34.1,62.78 X7.2 | v40.12,16.25 43.92,16.25 44.11,16.07 X11.GP11 | v37.62,23.12 36.25,24.5 25.75,24.5 v17.38,32.88 | v19.25,41 19.75,41.5 19.75,47 22.12,49.38 29.88,49.38 32.5,52 32.5,55.75 v31.88,56.38
DIREITA_NPN  (via drill 0.3)
  Top 0.26: v31.25,53.88 31.25,54.62 31,54.88 Q11.3 | v22.38,72.38 18.93,68.93 18.93,59.86 20.43,58.36 24.51,58.36 25.24,57.63 v25.24,56.45
  Bottom 0.26: v31.25,53.88 31.88,53.25 31.88,52.54 31.46,52.12 29.57,52.12 v25.24,56.45 | v22.38,72.38 22.5,72.5 28.75,72.5 31.65,75.4 X2.3
DIREITA_PNP  (via drill 0.3)
  Top 0.26: v31.25,35.25 31.25,37.25 31,37.5 Q10.C | v59.05,42.55 60.25,43.75 60.25,49.38 61.5,50.62 63,50.62 63.62,51.25 63.62,52.75 66.12,55.25 66.12,66 63.26,68.87 63.26,70.89 v61.93,72.22
  Bottom 0.26: v31.25,35.25 32,34.5 34.04,34.5 35.27,35.72 40.35,35.72 44.88,40.25 50,40.25 52.3,42.55 v59.05,42.55 | v61.93,72.22 61.65,72.5 57.88,72.5 54.97,75.41 X5.2
ENTRADA_S1
  Top 0.26: R29.2 26.5,31.62 26.5,30.75 24.88,29.12 24.88,27.62 26.5,26 IC3.7
  Bottom 0.26: IC3.7 26.62,25.88 27,25.88 27.75,25.12 44.62,25.12 44.75,25 58.92,25 X11.GP21
ENTRADA_S2
  Top 0.26: R32.2 IC3.5
  Bottom 0.26: X11.GP20 65.25,16.12 61.5,19.88 38,19.88 36.62,21.25 27.12,21.25 26.75,20.88 26.62,20.88 IC3.5
ESQUERDA  (via drill 0.3)
  Top 0.26: v21.88,64.62 21.88,67 21.25,67.62 20.25,67.62 R2.2 | v43.5,25.88 43.5,24 44,23.5 44,20.25 45.64,18.61 X11.GP10 | v21.49,33.3 20,34.79 20,42 19.75,42.25 19.75,45.25 v16.88,48.12 | v10.97,55.45 10.97,59.34 v12.88,61.25
  Bottom 0.26: v43.5,25.88 42.38,27 30.12,27 23.83,33.3 v21.49,33.3 | v12.88,61.25 16.25,64.62 v21.88,64.62 23.69,62.81 X1.2 | v16.88,48.12 10.97,54.03 v10.97,55.45
ESQUERDA_NPN
  Top 0.26: Q8.3 25.98,58.64 25.38,59.25 25.38,65.62 27.36,67.61 X2.2
ESQUERDA_PNP  (via drill 0.3)
  Top 0.26: v25.73,51.23 25.73,37.77 25.88,37.62 Q6.C
  Bottom 0.26: v25.73,51.23 20.33,56.62 16.38,56.62 12.12,60.88 12.12,73.25 13.88,75 13.88,77 15.25,78.38 45.38,78.38 48.34,75.41 X5.1
GND  (via drill 0.35)
  Top 0.26: LED1.C 10.23,67.32 v11.01,68.1 | IC2.1 31.95,19.49 32.43,19.97 | IC2.4 33.9,19.6 33.53,19.97 32.43,19.97 | IC2.13 32.59,20.14 32.43,19.97 | C1.2 60.21,52.2 58.64,50.63 v58.64,47.79 | C2.2 62.53,47.22 63.28,46.46 63.28,45.3 62.82,44.83 v61.92,44.83 | v53.42,43.9 53.42,40.15 IC1.3 | R21.1 21.65,55.16 20.92,55.9 20.92,56.75 18.33,59.34 18.33,63.2 18.17,63.35 v18.17,63.71 | Q5.2 54.49,66.53 51.63,69.39 v51.63,69.52 | v56.12,69.52 59.5,66.14 Q9.2 | R8.1 20.23,59.44 20.69,58.97 21.68,58.97 v21.95,59.24 | R25.1 23.02,40.61 v23.25,40.37 | Q14.2 39.35,54.78 39.35,53 | 39.35,53 39.35,47.32 38.35,46.31 30.4,46.31 v29.84,46.88 | 39.35,53 41.02,51.34 41.02,47.55 42.02,46.55 X11.GND@1 48.99,46.55 49.84,47.39 49.84,48.84 51.47,50.47 v51.47,51.51 | Q4.2 44.27,55.94 45.32,54.89 48.97,54.89 v49.69,54.17
  Bottom 0.26: X9.1 11.01,75.05 v11.01,68.1 | v53.42,43.9 54.36,44.83 60,44.83 | v21.95,59.24 21.95,60.86 20.47,62.34 20.47,63.58 v20.19,63.86 18.33,63.86 v18.17,63.71 | v51.63,69.52 51.63,70.64 52.11,71.12 55.73,71.12 56.12,70.73 v56.12,69.52 | X11.GND@2 55.28,41.59 60.77,41.59 61.41,42.24 61.41,43.41 60,44.83 | v23.25,40.37 24.01,40.37 25.61,41.98 25.61,44.16 28.33,46.88 v29.84,46.88 | v49.69,54.17 51.47,52.39 v51.47,51.51 | 60,44.83 61,44.83 | 61,44.83 v61.92,44.83 | v58.64,47.79 60,46.44 60,45.83 61,44.83
  pour Top: 0,0 0,80 80,80 80,0
  pour Bottom: 80,0 0,0 0,80 80,80
ID_1
  Bottom 0.26: X11.GP19 66.78,13.53 72.26,19.01 X4.1
ID_2
  Bottom 0.26: X11.GP18 66.76,10.99 68.9,8.85 X4.3
MISO  (via drill 0.3)
  Top 0.26: IC2.11 33.91,23.84 33.91,24.48 34.17,24.73 37.1,24.73 38.42,23.42 38.42,22.02 v38.89,21.55 | X11.GP16 56.87,11.81 v56.87,20.66
  Bottom 0.26: v38.89,21.55 44.5,21.55 45.39,22.44 55.08,22.44 v56.87,20.66
MOSI
  Top 0.26: R22.1 52,21 50,23 50,36.38 49.25,37.12 49.25,39.75 47.62,41.38 X11.GP3
N$1  (via drill 0.3)
  Top 0.26: v22,38.5 22,38.25 23,37.25 R5.2
  Bottom 0.26: Q3.1 20.76,37.26 v22,38.5
N$2  (via drill 0.3)
  Top 0.26: v22.75,51.5 22.75,50.5 23,50.25 R12.2
  Bottom 0.26: Q7.1 21.41,50.16 v22.75,51.5
N$3
  Top 0.26: X13.1 4.71,17.16 5.62,16.25 5.62,11 4.5,9.88 X12.2
N$4
  Bottom 1.397: X9.2 16.36,75.4 21.24,70.53 22.35,70.53 24.75,68.12 74.25,68.12 74.38,68 D2.A
N$5
  Top 0.26: Q8.1 28.12,54 28,53.88 28,50.12 R13.2
N$6
  Top 0.26: LED1.A 7.62,67.38 8.12,67.88 8.12,68.38 8.62,68.88 13,68.88 14.17,67.71 R17.1
N$7
  Top 0.26: R18.1 14.19,64.69 13,65.88 9.09,65.88 LED2.A
N$8
  Top 0.26: LED3.A 7.62,61.25 8.12,60.75 8.12,60 9.88,58.25 9.88,55 11.25,53.62 13,53.62 14.12,54.75 14.12,60.5 R19.1
N$9
  Bottom 1.397: D2.C 74.5,52.62 74.5,47.5 F1.2
N$10
  Top 0.26: Q4.1 43.12,54 43,53.88 43,50.12 R6.2
N$11
  Bottom 1.397: 9.88,42.75 12.25,45.12 D1.A | 9.88,42.75 6.38,42.75 4.62,44.5 4.62,44.88 X3.2 | 9.88,42.75 13.26,42.75 16.21,39.8 Q3.2
N$12  (via drill 0.3)
  Top 0.26: v57,61.38 57,63.75 57.25,64 Q9.3 | v49.16,62.86 48.77,62.46 48.77,59.02 47.12,57.38 42.17,57.38 41.38,56.58 v41.38,56.38 | v28.62,45.38 27.62,44.38 27.62,44.25 R9.1 28,44.62 28,44.5 29.62,42.88 29.62,39.25 v29.5,39.12 | v28.25,35.5 28.25,32.75 29.88,31.12 R11.1
  Bottom 0.26: v57,61.38 56.88,61.25 49.69,61.25 49.33,61.61 49.33,62.69 v49.16,62.86 | v41.38,56.38 30.38,45.38 v28.62,45.38 | v28.25,35.5 29.5,36.75 v29.5,39.12
N$13
  Bottom 1.397: X8.2 4.75,56.62 5.38,56.62 7.38,58.62 11.38,58.62 12.25,57.75 D3.A 12.62,57.12 16.75,53 17.75,53 18,52.75 Q7.2
N$14
  Top 0.26: Q9.1 59.5,59.62 R14.2
N$15
  Top 0.26: Q6.B 28.25,36.62 29.88,35 29.88,33 R11.2
N$16  (via drill 0.3)
  Top 0.26: v66.88,62.88 66.88,63.62 67.25,64 Q15.3 | v51.25,62.88 50.88,62.5 50.88,59.25 v47.38,55.75 | v37,45.5 36.62,45.12 36.62,44.25 R31.1 36.5,44.25 34.88,42.62 34.88,36.88 35.75,36 35.75,32 36.62,31.12 38,31.12 R33.1
  Bottom 0.26: v51.25,62.88 v66.88,62.88 | v47.38,55.75 47.25,55.62 44,55.62 37,48.62 v37,45.5
N$17  (via drill 0.3)
  Top 0.26: v48.38,55.62 52,59.25 52,63.75 52.25,64 Q5.3 | v40.13,50.65 40.13,45.03 R1.1 41,44.25 39.38,42.62 39.38,40.25 39.88,39.75 39.88,35 40.5,34.38 40.5,32.5 41.88,31.12 R3.1
  Bottom 0.26: v48.38,55.62 47.75,55 44.48,55 v40.13,50.65
N$18
  Top 0.26: Q5.1 54.5,63 54.5,59.62 R7.2
N$19
  Top 0.26: Q11.1 33.12,54 33,53.88 33,50.12 R23.2
N$20
  Top 0.26: Q1.B 43.12,36.62 42.38,35.88 42.38,33.38 42,33 R3.2
N$21
  Top 0.26: Q15.1 69.5,59.62 R36.2
N$22
  Top 0.26: Q14.1 38.12,54 38,53.88 38,50.12 R35.2
N$23
  Top 0.26: X11.GP28_A2 60.89,36.39 C4.1
N$24
  Top 0.26: Q13.B 38.12,36.62 38.12,33 R33.2
N$25
  Top 0.26: C4.2 60.88,34.38 63.05,34.38 63.58,33.85 X11.AGND
N$26  (via drill 0.3)
  Top 0.26: v62,62.12 62,63.75 62.25,64 Q12.3 | v44.88,56.38 46.88,56.38 49.75,59.25 49.75,61.75 v50.12,62.12 | v32.62,45.5 32.12,45 32.12,44.25 R16.1 32,44.25 30.38,42.62 30.38,39.2 v30.84,38.74 | v32.38,35.25 32.38,32 33.25,31.12 34,31.12 R20.1
  Bottom 0.26: v50.12,62.12 v62,62.12 | v44.88,56.38 44.75,56.25 43.38,56.25 v32.62,45.5 | v32.38,35.25 30.84,36.79 v30.84,38.74
N$27
  Top 0.26: Q2.1 40,18.88 39.62,19.25 39.62,24.38 40,24.75 40,25.88 R4.2
N$28
  Top 0.26: Q12.1 64.5,63.12 64.5,59.62 R24.2
N$29
  Top 0.26: Q10.B 33.25,36.62 34,35.88 34,33 R20.2
N$30  (via drill 0.3)
  Top 0.26: v37.38,11.75 43.12,17.5 43.12,20.63 42.76,21 41.12,21 Q2.3
  Bottom 0.26: v37.38,11.75 34,8.38 22.62,8.38 LS1.2
N$36
  Top 0.26: 17.25,30.38 18.5,31.62 R30.1 17.25,30.4 17.25,30.38 | IC3.3 17.25,25.07 17.25,30.38
N$37
  Top 0.26: IC3.1 20.5,26.9 20.5,19.8 18.95,18.25 R28.1
N$38  (via drill 0.3)
  Top 0.26: v32.62,16.12 32.62,17.88 IC2.2 | v55.25,16.62 55.5,16.88 55.5,18.38 54,19.88 54,21 R22.2
  Bottom 0.26: v32.62,16.12 32,15.5 32,14.84 32.46,14.38 44.38,14.38 44.75,14.75 53.38,14.75 v55.25,16.62
N$39  (via drill 0.3)
  Top 0.26: v35.12,19.12 34.62,18.62 34.62,18 IC2.5 | R26.2 53.95,18.27 53.31,18.9 v50.22,18.9
  Bottom 0.26: v35.12,19.12 36.88,17.38 48.7,17.38 v50.22,18.9
N$40  (via drill 0.3)
  Top 0.26: v36.25,20.5 36.25,22.25 35.25,23.25 35.25,23.75 IC2.9 | v43.88,18.12 44.12,17.88 44.12,16 45.38,14.75 48.7,14.75 49.69,13.77 49.69,12.69 51.12,11.25 53.22,11.25 53.88,11.9 53.88,13 R27.2
  Bottom 0.26: v36.25,20.5 38.62,18.12 v43.88,18.12
N$41  (via drill 0.3)
  Top 0.26: v34.33,20.5 34.33,22.17 33.25,23.25 33.25,23.75 IC2.12 | v42.5,15.12 45.38,12.25 49.38,12.25 51,10.62 53.19,10.62 53.88,9.94 53.88,9 R34.2
  Bottom 0.26: v42.5,15.12 37.88,15.12 34.33,18.67 v34.33,20.5
NPN_BLOQ
  Top 0.26: R35.1 37.88,48.25 36,48.25 34.88,49.38 34.88,55.62 35.62,56.38 35.62,58.38 37.62,60.38 37.62,63.5 39.45,65.32 X6.1
NPN_DIR  (via drill 0.3)
  Top 0.26: v31.12,52.88 31.12,49 31.88,48.25 32.88,48.25 R23.1 | v30.62,56.38 31.25,57 31.25,63.5 33.09,65.34 X7.1
  Bottom 0.26: v31.12,52.88 30.5,53.5 30.5,56.38 v30.62,56.38
NPN_ESQ
  Top 0.26: R13.1 28,48.25 29,48.25 29.88,49.12 29.88,58.75 30.62,59.5 30.62,63.5 28.78,65.35 X1.1
NPN_STAND_BY
  Top 0.26: R6.1 42.88,48.12 41.75,49.25 41.75,51.12 41.88,51.25 41.88,53.12 41.5,53.5 40.38,53.5 39.88,54 39.88,57.06 40.68,57.87 41.97,57.87 44.01,59.91 44.01,64 45.35,65.34 X10.1
PNP_BLOQ  (via drill 0.3)
  Top 0.26: v67.18,56.49 68.29,56.49 R36.1
  Bottom 0.26: v67.18,56.49 51.13,56.49 48.75,58.88 43.25,58.88 41.88,60.24 X6.3
PNP_DIR  (via drill 0.3)
  Top 0.26: v39.88,72.23 36.88,69.23 36.88,62.12 35.01,60.26 X7.3 | R24.1 64.38,57.75 61.12,61 61.12,66 58.38,68.74 58.38,71.15 57.31,72.23 v56.44,72.23
  Bottom 0.26: v56.44,72.23 v56.43,72.23 v39.88,72.23
PNP_ESQ  (via drill 0.3)
  Top 0.26: v53,60.5 52.88,60.62 52.88,62.88 53.38,63.38 53.38,66.11 48.24,71.24 v46.03,71.24 | v34.98,72.24 31.57,68.83 v31.57,65.45 | R14.1 59.38,57.75 58.63,57.75 v57.07,59.32
  Bottom 0.26: v57.07,59.32 55.88,60.5 v53,60.5 | v46.03,71.24 37.03,71.24 36.03,72.24 v34.98,72.24 | v31.57,65.45 31.57,61.07 30.77,60.27 X1.3
PNP_STAND_BY  (via drill 0.3)
  Top 0.26: v51.52,57.51 54.31,57.51 R7.1
  Bottom 0.26: v51.52,57.51 49.53,59.5 49,59.5 48.23,60.27 X10.3
S1  (via drill 0.3)
  Top 0.26: v20.25,15.5 20.6,15.5 20.85,15.75 R28.2
  Bottom 0.26: v20.25,15.5 19.62,16.12 11.12,16.12 4.71,22.54 X13.2
S2  (via drill 0.3)
  Top 0.26: v21.07,30.21 21.54,30.21 21.81,30.49 21.81,31.28 21.39,31.7 R30.2
  Bottom 0.26: v21.07,30.21 17.66,33.62 10.75,33.62 5.32,28.19 X13.3
SCK
  Top 0.26: R26.1 52.12,17 52.12,15.77 53.27,14.62 55.77,14.62 56.12,14.98 56.12,31 50,37.12 50,41.54 X11.GP2
SD_PIN2
  Top 0.26: IC2.8 35.88,23.75 37,22.62 37,16.38 35.75,15.12 35.75,13.88 J1.P2
SD_PIN3  (via drill 0.3)
  Top 0.26: v33,19.12 33,18.75 33.25,18.5 33.25,18 IC2.3 | v34.25,15.88 34.62,15.5 34.62,13.88 J1.P3
  Bottom 0.26: v33,19.12 34.25,17.88 v34.25,15.88
SD_PIN5  (via drill 0.3)
  Top 0.26: v35.12,16.38 35.12,17.75 35.25,17.88 IC2.6 | v32.75,15.12 32.5,14.88 32.5,13.88 J1.P5
  Bottom 0.26: v32.75,15.12 34.58,15.12 35.12,15.67 v35.12,16.38
SD_PIN7
  Top 0.26: J1.P7 30.25,13.75 30.25,12.5 31.75,11 40.5,11 44.38,7.12 51,7.12 52,8.12 52,9 R34.1
SENSOR1
  Bottom 0.26: X14.2 13.32,20.4 IC3.2
SENSOR2
  Bottom 0.26: IC3.4 20.38,22.38 20.38,26.3 19.3,27.38 16,27.38 14.07,29.3 X15.2
STAND_BY  (via drill 0.3)
  Top 0.26: v23.5,64.12 23.5,62.62 R15.2 | v24.38,70.38 21.71,70.38 v20.58,69.25 | v45.88,69.5 49.38,66 49.38,64.62 47.55,62.8 X10.2
  Bottom 0.26: v23.5,64.12 20.58,67.04 v20.58,69.25 | v24.38,70.38 25.25,69.5 v45.88,69.5 | X10.2 47.8,62.8 51.12,66.12 68.02,66.12 68.88,65.27 68.88,56.75 71.25,54.38 71.25,33.38 66.64,28.77 X11.GP26_A0
STAND_BY_NPN
  Top 0.26: Q4.3 44,55 45.92,53.08 53.7,53.08 55.78,55.15 55.78,66.88 50.28,72.38 44.27,72.38 42.6,74.05 X2.5
STAND_BY_PNP  (via drill 0.3)
  Top 0.26: v41.62,35.88 41.62,37 41.12,37.5 Q1.C | v50.75,39.88 50.75,48.25 56.29,53.79 56.29,59.61 57.56,60.88 v58.12,60.88 | X5.4 64.39,70 67.62,66.77 v67.62,65.38
  Bottom 0.26: v41.62,35.88 43.38,37.62 48.5,37.62 v50.75,39.88 | v67.62,65.38 67.62,62.5 66.5,61.38 60.82,61.38 60.32,60.88 v58.12,60.88
TIPO_CATRACA(C_F)  (via drill 0.3)
  Top 0.26: v44.25,24.38 44.25,27.38 45.64,28.77 X11.GP7
  Bottom 0.26: v44.25,24.38 42.25,22.38 26.12,22.38 21,17.25 21,13.49 19.51,12 13,12 10.9,9.9 X16.2

### Text on the board
tPlace: Facial / Controller / Board V5.0
tNames: GND | 12V | 12V | ESQ | DIR | BLOQ | AZUL | ESQ | DIR | BLOQ | AZUL | GND | (NPN) | (PNP) | ESQ+ | BLOQ+ | AZUL+ | +12V | DIR+ | +5V | BLOQ- | ESQ- | DIR- | AZUL- | BY: Bruno Ribeiro / Johan | +3.3V | SOL2 | 12V | SOL1 | 12V | GND | GND | S2 | 5V | GND | S1 | 5V | ID_1 | 5/12V | 12V | C | COM | 5V | F | + | - | ID_2